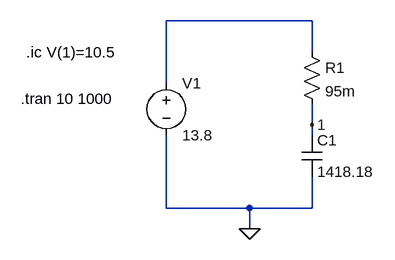
[diagram p0: schematic charging_process.asc]
charging_process.asc, the LTspice schematic file:
Version 4
SHEET 1 884 680
WIRE 368 -48 144 -48
WIRE 368 0 368 -48
WIRE 144 48 144 -48
WIRE 368 112 368 80
WIRE 368 128 368 112
WIRE 144 240 144 128
WIRE 272 240 144 240
WIRE 368 240 368 192
WIRE 368 240 272 240
WIRE 272 272 272 240
FLAG 272 272 0
FLAG 368 112 1
SYMBOL cap 352 128 R0
SYMATTR InstName C1
SYMATTR Value 1418.18
SYMBOL voltage 144 32 R0
WINDOW 123 0 0 Left 0
WINDOW 39 0 0 Left 0
SYMATTR InstName V1
SYMATTR Value 13.8
SYMBOL res 352 -16 R0
SYMATTR InstName R1
SYMATTR Value 95m
TEXT -80 72 Left 2 !.tran 10 1000
TEXT -72 0 Left 2 !.ic V(1)=10.5

The netlist it stands for:
* charging_process.asc
C1 1 0 1418.18
V1 N001 0 13.8
R1 N001 1 95m
.tran 10 1000
.ic V(1)=10.5
.backanno
.end